# EAGLE design OSO-MISC-21-022 Temperature + GPIO + I2C Board (EAGLE 9.6.2)
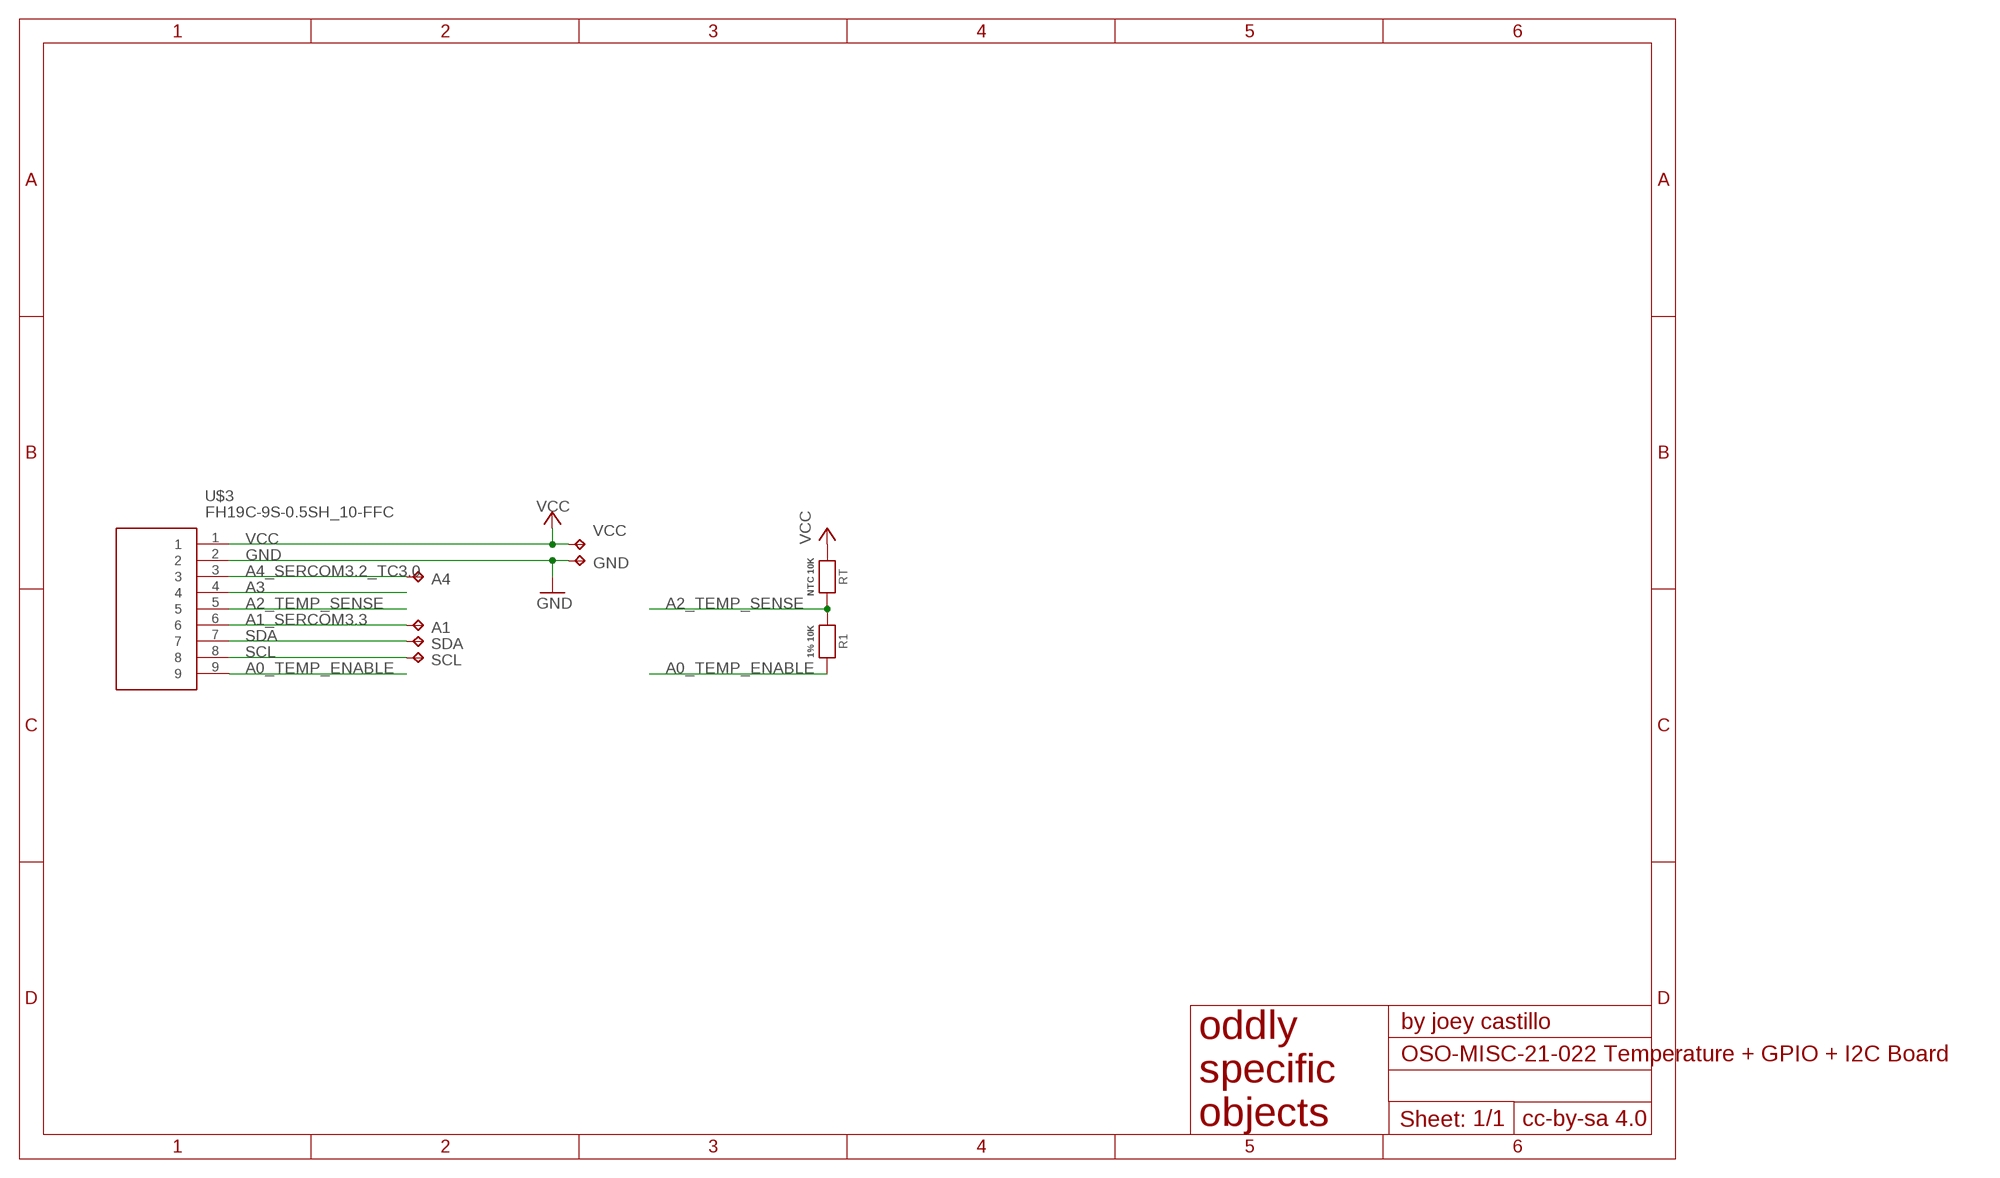
[diagram p0: schematic, sheet 1]

## Parts
A1  TPB1,27  [B1,27]
A4  TPB1,27  [B1,27]
GND  TPB1,27  [B1,27]
R1  1% 10K  RESISTOR_0603MP  [_0603MP]
RT  NTC 10K  RESISTOR_0603MP  [_0603MP]
SCL  TPB1,27  [B1,27]
SDA  TPB1,27  [B1,27]
U$3  FH19C-9S-0.5SH_10-FFC  [FH19C9S05SH10-FFC]
VCC  TPB1,27  [B1,27]

## Nets
A0_TEMP_ENABLE: R1.2 U$3.9
A1_SERCOM3.3: A1.TP U$3.6
A2_TEMP_SENSE: R1.1 RT.2 U$3.5
A3: U$3.4
A4_SERCOM3.2_TC3.0: A4.TP U$3.3
GND [gnd]: GND.TP U$3.2
SCL: SCL.TP U$3.8
SDA: SDA.TP U$3.7
VCC [power]: RT.1 U$3.1 VCC.TP

## Library data of the parts
A1 A4 GND SCL SDA VCC = testpad:TP: Test pad
R1 RT = microbuilder:RESISTOR: Resistors For new designs, use the packages preceded by an '_' character since they are more reliable: The following footprints should be used on most boards: _0402 - Standard footprint for regular board layouts _0603 - Standard footprint for regular board layouts _0805 - Standard footprint for regular board layouts _1206 - Standard footprint for regular board layouts For extremely tight-pitch boards where space is at a premium, the following 'micro-pitch' footprints can be used (smaller pads, no silkscreen outline, etc.): _0402MP - Micro-pitch footprint for very dense/compact boards _0603MP - Micro-pitch footprint for very dense/compact boards _0805MP - Micro-pitch footprint for very dense/compact boards _1206MP - Micro-pitch footprint for very dense/compact boards
U$3 = FH19C-9S-0.5SH:FH19C-9S-0.5SH_10-FFC

## Net classes
0 default: width 0.203 mm
1 power: width 0.203 mm
2 gnd: width 0.203 mm

## Board
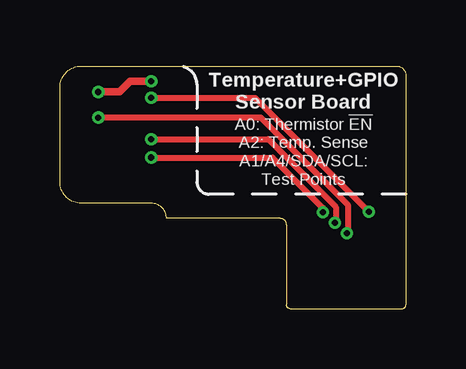
[diagram p1: board, top side]
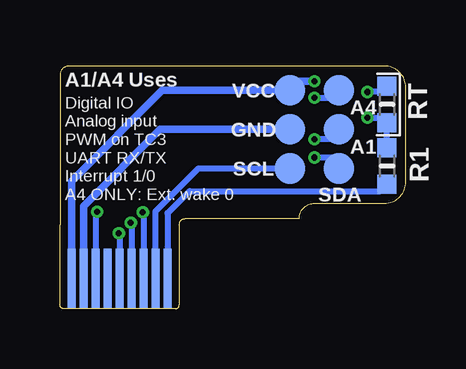
[diagram p2: board, bottom side, seen from below]

Size 14.43 x 10.1 mm. Coordinates in mm from the lower left corner, seen from the top.
Outline: 9.45,3.5 arc90 9.2,3.75 4.45,3.75 arc90 3.81,4.39 0.89,4.39 arc-90 0,5.28 0,9.21 arc-90 0.89,10.1 14.05,10.1 arc-90 14.43,9.72 14.43,3.5
Copper layers (1*16): Top 0.035559375mm / dielectric 1.6mm / Bottom 0.035559375mm
Design rules "oshpark-2layer *": minimum track width 6mil, minimum drill 10mil, track to track 6mil, track to pad 6mil, pad to pad 6mil, via to via 6mil, smd to smd 6mil, copper to edge 15mil, drill to drill 6mil, minimum pad ring 5mil, minimum via ring 5mil, stop-mask expansion 2.5mil, vias tented up to drill 12mil, thermal gap 10mil

### Footprints (pad centres in the part's own frame; a part is rotated, then mirrored left to right if it is on the bottom)
B1,27 = smd 1.27 x 1.27: TP 0,0
_0603MP = smd 0.8 x 0.8: 1 -0.762,0; 2 0.762,0
FH19C9S05SH10-FFC = smd 0.347 x 2.5 bottom: 1 2,-2.25; 2 1.5,-2.25; 3 1,-2.25; 4 0.5,-2.25; 5 0,-2.25; 6 -0.5,-2.25; 7 -1,-2.25; 8 -1.5,-2.25; 9 -2,-2.25

### Placement (x,y rotation side)
A1  2.79,7.46 0 bottom
A4  2.79,9.09 0 bottom
GND  4.83,7.46 0 bottom
R1  0.79,5.94 270 bottom
RT  0.79,8.5 270 bottom
SCL  4.83,5.84 0 bottom
SDA  2.79,5.84 0 bottom
U$3  11.94,3.5 0 top
VCC  4.83,9.09 0 bottom

### Tracks (layer width: path | path; a pad name or v marks a point on that pad's centre or on a via)
A0_TEMP_ENABLE
  Bottom 0.254: U$3.9 9.94,3.98 9.02,4.9 1.07,4.9 R1.2
A1_SERCOM3.3  (via drill 0.25)
  Top 0.254: v11.47,3.57 11.51,3.61 11.51,4.24 8.69,7.06 v3.81,7.06
  Bottom 0.254: v11.47,3.57 11.44,3.54 U$3.6 | A1.TP 2.79,7.21 2.95,7.06 v3.81,7.06
A2_TEMP_SENSE  (via drill 0.25)
  Top 0.254: v11.97,3.14 12.01,3.17 12.01,4.33 8.38,7.96 v1.6,7.96
  Bottom 0.254: v11.97,3.14 11.94,3.11 U$3.5 | R1.1 RT.2 1,7.96 v1.6,7.96
A4_SERCOM3.2_TC3.0  (via drill 0.25)
  Top 0.254: v3.81,8.78 8.14,8.78 v12.88,4.04
  Bottom 0.254: A4.TP 2.79,9.04 3.05,8.78 v3.81,8.78 | v12.88,4.04 12.94,3.98 U$3.3
GND
  Bottom 0.305: GND.TP 10.25,7.46 13.44,4.27 U$3.2
SCL
  Bottom 0.254: U$3.8 10.44,4.05 8.65,5.84 SCL.TP
SDA  (via drill 0.25)
  Top 0.254: v3.81,6.29 8.87,6.29 10.97,4.19 v10.97,4.01
  Bottom 0.254: SDA.TP 2.79,6.29 v3.81,6.29 | v10.97,4.01 10.94,3.98 U$3.7
VCC  (via drill 0.25)
  Top 0.305: v3.81,9.47 2.93,9.47 2.49,9.03 v1.6,9.03
  Bottom 0.254: RT.1 1.03,9.03 v1.6,9.03
  Bottom 0.305: v3.81,9.47 4.45,9.47 VCC.TP 10.16,9.09 13.94,5.31 U$3.1

### Text on the board
tPlace: Temperature+GPIO / Sensor Board | A0: Thermistor !EN / A2: Temp. Sense / A1/A4/SDA/SCL: / Test Points
bPlace: A1/A4 Uses | Digital IO / Analog input / PWM on TC3 / UART RX/TX / Interrupt 1/0 / A4 ONLY: Ext. wake 0